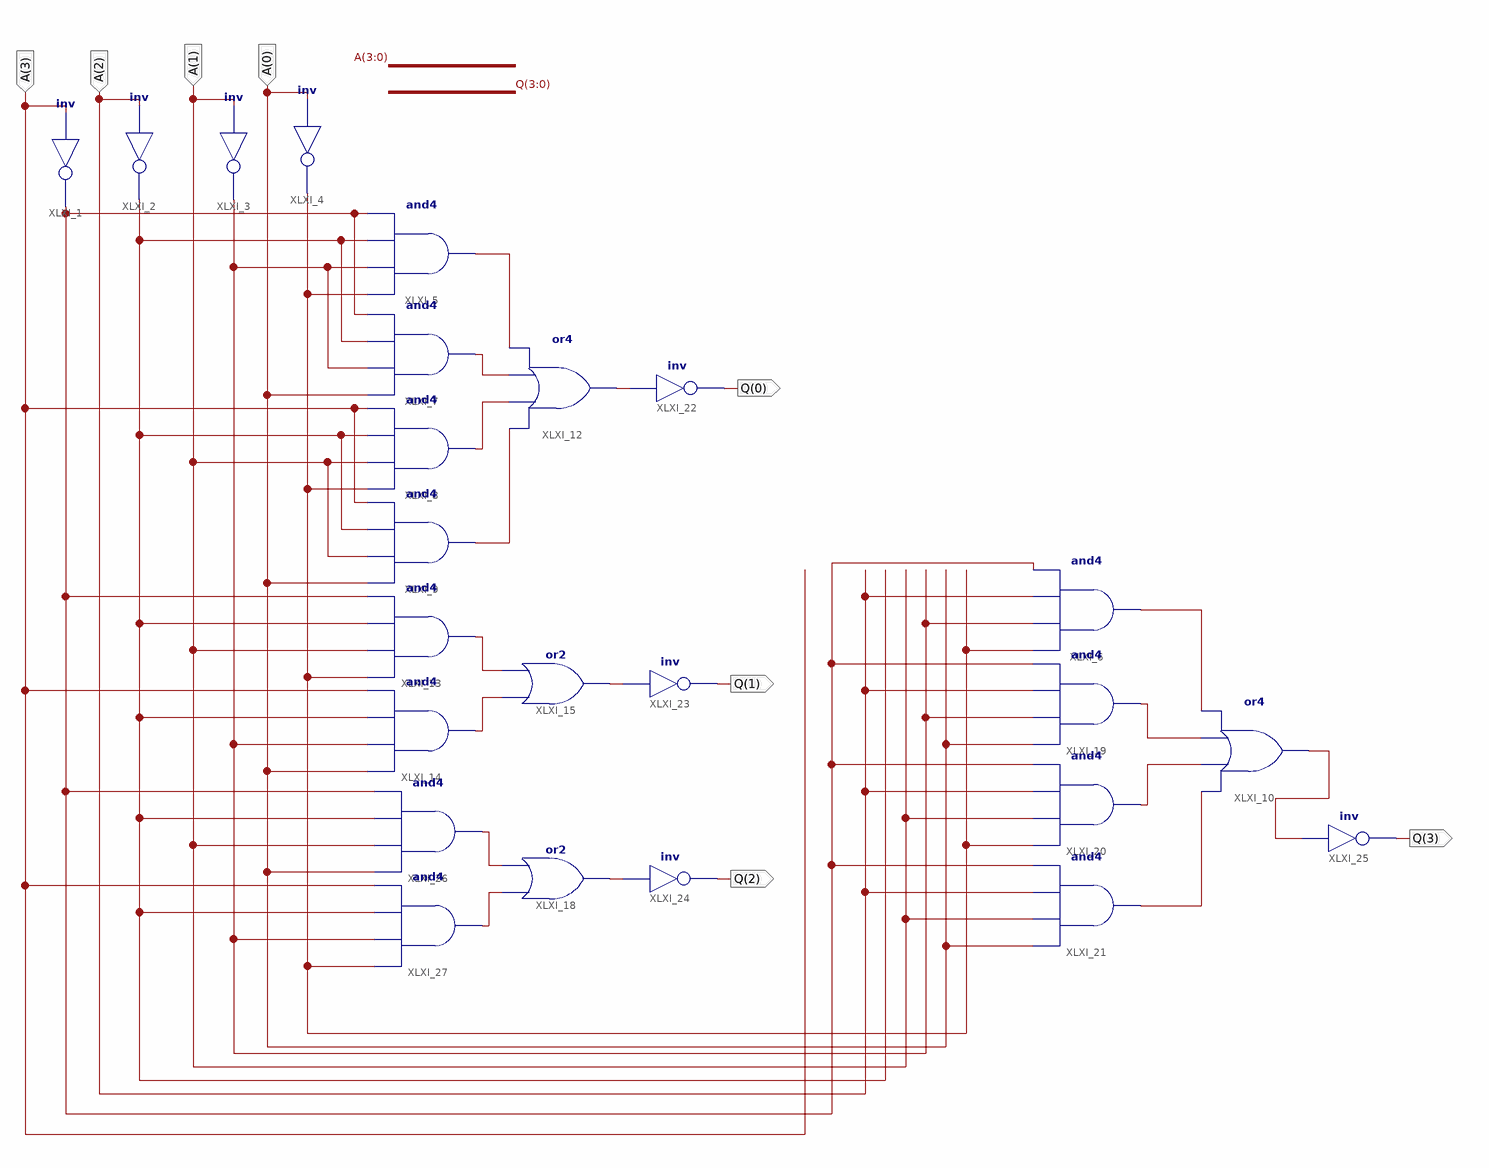
[diagram p0: schematic sheet 1]
// Xilinx ISE schematic encoder.sch (spartan6) as structural Verilog: 24 symbols, 8 ports
module encoder (
  input  [3:0] A,
  output [3:0] Q
);

  wire XLXN_5, XLXN_12, XLXN_14, XLXN_16, XLXN_18, XLXN_19, XLXN_20, XLXN_21, XLXN_26, XLXN_27, XLXN_40,
       XLXN_41, XLXN_45, XLXN_46, XLXN_47, XLXN_48, XLXN_63, XLXN_64, XLXN_65, XLXN_66;

  not XLXI_1 (XLXN_12, A[3]);
  not XLXI_2 (XLXN_16, A[2]);
  not XLXI_3 (XLXN_14, A[1]);
  not XLXI_4 (XLXN_5, A[0]);
  and XLXI_5 (XLXN_18, XLXN_5, XLXN_14, XLXN_16, XLXN_12);
  and XLXI_6 (XLXN_45, XLXN_5, XLXN_14, A[2], XLXN_12);
  and XLXI_7 (XLXN_19, A[0], XLXN_14, XLXN_16, XLXN_12);
  and XLXI_8 (XLXN_20, XLXN_5, A[1], XLXN_16, A[3]);
  and XLXI_9 (XLXN_21, A[0], A[1], XLXN_16, A[3]);
  or XLXI_12 (XLXN_63, XLXN_21, XLXN_20, XLXN_19, XLXN_18);
  and XLXI_13 (XLXN_26, XLXN_5, A[1], XLXN_16, XLXN_12);
  and XLXI_14 (XLXN_27, A[0], XLXN_14, XLXN_16, A[3]);
  or XLXI_15 (XLXN_64, XLXN_27, XLXN_26);
  or XLXI_18 (XLXN_65, XLXN_41, XLXN_40);
  and XLXI_19 (XLXN_46, A[0], XLXN_14, A[2], XLXN_12);
  and XLXI_20 (XLXN_47, XLXN_5, A[1], A[2], XLXN_12);
  and XLXI_21 (XLXN_48, A[0], A[1], A[2], XLXN_12);
  not XLXI_22 (Q[0], XLXN_63);
  not XLXI_23 (Q[1], XLXN_64);
  not XLXI_24 (Q[2], XLXN_65);
  not XLXI_25 (Q[3], XLXN_66);
  or XLXI_10 (XLXN_66, XLXN_48, XLXN_47, XLXN_46, XLXN_45);
  and XLXI_26 (XLXN_40, A[0], A[1], XLXN_16, XLXN_12);
  and XLXI_27 (XLXN_41, XLXN_5, XLXN_14, XLXN_16, A[3]);
endmodule
